# EAGLE schematic qPCR_pcb_breakout_ADG731BSUZ (EAGLE 9.6.1)
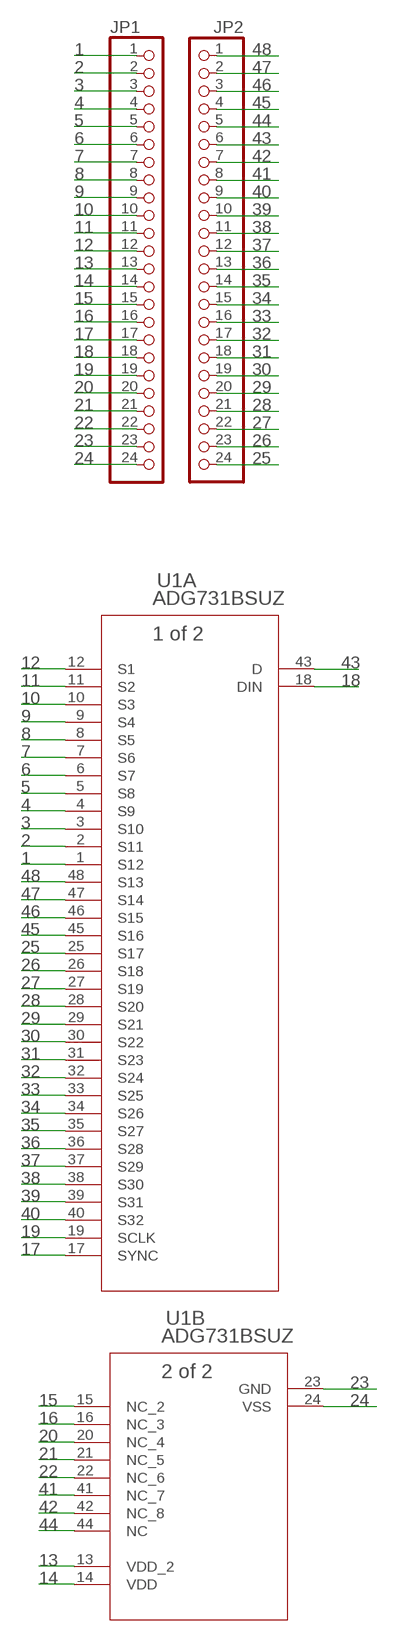
[diagram p0: schematic, sheet 1]

## Parts
JP1  PINHD-1X24  [1X24]
JP2  PINHD-1X24  [1X24]
U1  ADG731BSUZ  [SU_48_ADI]

## Nets
1: JP1.1 U1.1(A:S12)
2: JP1.2 U1.2(A:S11)
3: JP1.3 U1.3(A:S10)
4: JP1.4 U1.4(A:S9)
5: JP1.5 U1.5(A:S8)
6: JP1.6 U1.6(A:S7)
7: JP1.7 U1.7(A:S6)
8: JP1.8 U1.8(A:S5)
9: JP1.9 U1.9(A:S4)
10: JP1.10 U1.10(A:S3)
11: JP1.11 U1.11(A:S2)
12: JP1.12 U1.12(A:S1)
13: JP1.13 U1.13(B:VDD_2)
14: JP1.14 U1.14(B:VDD)
15: JP1.15 U1.15(B:NC_2)
16: JP1.16 U1.16(B:NC_3)
17: JP1.17 U1.17(A:SYNC)
18: JP1.18 U1.18(A:DIN)
19: JP1.19 U1.19(A:SCLK)
20: JP1.20 U1.20(B:NC_4)
21: JP1.21 U1.21(B:NC_5)
22: JP1.22 U1.22(B:NC_6)
23: JP1.23 U1.23(B:GND)
24: JP1.24 U1.24(B:VSS)
25: JP2.24 U1.25(A:S17)
26: JP2.23 U1.26(A:S18)
27: JP2.22 U1.27(A:S19)
28: JP2.21 U1.28(A:S20)
29: JP2.20 U1.29(A:S21)
30: JP2.19 U1.30(A:S22)
31: JP2.18 U1.31(A:S23)
32: JP2.17 U1.32(A:S24)
33: JP2.16 U1.33(A:S25)
34: JP2.15 U1.34(A:S26)
35: JP2.14 U1.35(A:S27)
36: JP2.13 U1.36(A:S28)
37: JP2.12 U1.37(A:S29)
38: JP2.11 U1.38(A:S30)
39: JP2.10 U1.39(A:S31)
40: JP2.9 U1.40(A:S32)
41: JP2.8 U1.41(B:NC_7)
42: JP2.7 U1.42(B:NC_8)
43: JP2.6 U1.43(A:D)
44: JP2.5 U1.44(B:NC)
45: JP2.4 U1.45(A:S16)
46: JP2.3 U1.46(A:S15)
47: JP2.2 U1.47(A:S14)
48: JP2.1 U1.48(A:S13)

## Library data of the parts
JP1 JP2 = pinhead:PINHD-1X24: PIN HEADER
U1 = Ninja_qPCR:ADG731BSUZ; BUILT_BY: EMA_UL_Team; MANUFACTURER_PART_NUMBER: ADG731BSUZ; SOURCELIBRARY: Analog_2012-01-01_7; VENDOR: Analog Devices Inc